# EAGLE schematic electric_xmas (EAGLE 6.3)

## Sheet 1 of 2
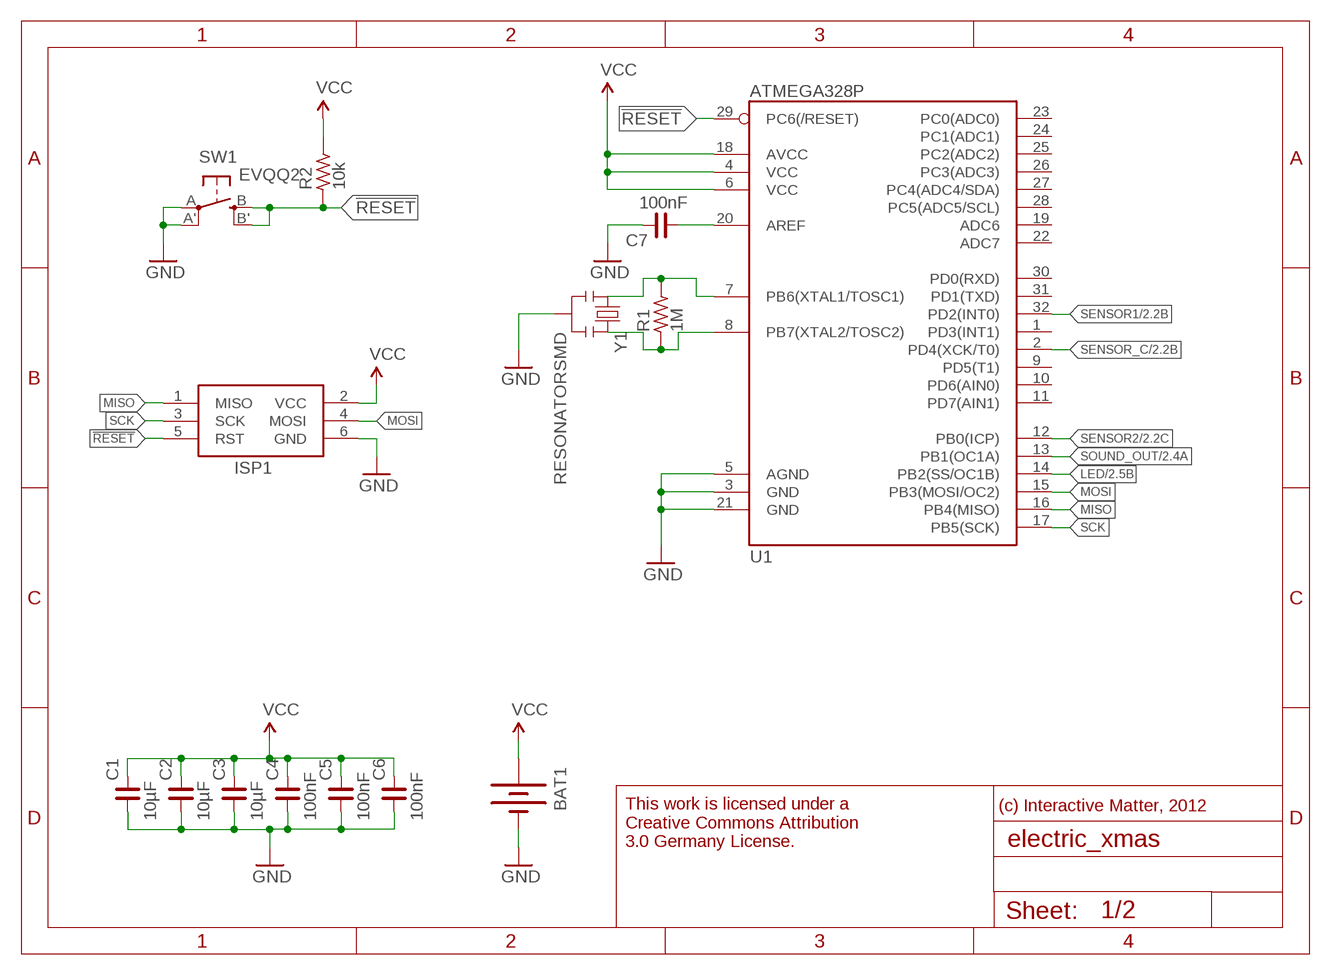
[diagram p0: schematic, sheet 1]

### Parts
BAT1  BATTERY20SMD  [BATTCON_20MM]
C1  10µF  C_0805  [C0805]
C2  10µF  C_0805  [C0805]
C3  10µF  C_0805  [C0805]
C4  100nF  C_0805  [C0805]
C5  100nF  C_0805  [C0805]
C6  100nF  C_0805  [C0805]
C7  100nF  C_0805  [C0805]
ISP1  AVRISP-6  [AVRISP]
R1  1M  R_0805  [R0805]
R2  10k  R_0805  [R0805]
SW1  EVQQ2  [EVQ-Q2]
U1  ATMEGA328P  ATMEGA168  [TQFP32-08]
Y1  RESONATORSMD  [RESONATOR-SMD]

### Nets
!RESET: ISP1.5(RST) R2.1 SW1.B'(S1) SW1.B(S) U1.29(PC6(/RESET))
GND: BAT1.2(-) C1.1 C2.1 C3.1 C4.1 C5.1 C6.1 C7.2 ISP1.6(GND) SW1.A'(P1) SW1.A(P) U1.3(GND) U1.5(AGND) U1.21(GND) Y1.2 ; also sheet 2
LED: U1.14(PB2(SS/OC1B)) ; also sheet 2
MISO: ISP1.1(MISO) U1.16(PB4(MISO))
MOSI: ISP1.4(MOSI) U1.15(PB3(MOSI/OC2))
N$1: R1.2 U1.7(PB6(XTAL1/TOSC1)) Y1.1
N$2: R1.1 U1.8(PB7(XTAL2/TOSC2)) Y1.3
N$5: C7.1 U1.20(AREF)
SCK: ISP1.3(SCK) U1.17(PB5(SCK))
SENSOR1: U1.32(PD2(INT0)) ; also sheet 2
SENSOR2: U1.12(PB0(ICP)) ; also sheet 2
SENSOR_C: U1.2(PD4(XCK/T0)) ; also sheet 2
SOUND_OUT: U1.13(PB1(OC1A)) ; also sheet 2
VCC: BAT1.1(+) C1.2 C2.2 C3.2 C4.2 C5.2 C6.2 ISP1.2(VCC) R2.2 U1.4(VCC) U1.6(VCC) U1.18(AVCC)
Unconnected: U1.1(PD3(INT1)) U1.9(PD5(T1)) U1.10(PD6(AIN0)) U1.11(PD7(AIN1)) U1.19(ADC6) U1.22(ADC7) U1.23(PC0(ADC0)) U1.24(PC1(ADC1)) U1.25(PC2(ADC2)) U1.26(PC3(ADC3)) U1.27(PC4(ADC4/SDA)) U1.28(PC5(ADC5/SCL)) U1.30(PD0(RXD)) U1.31(PD1(TXD))

### Notes on the sheet
- (c) Interactive Matter, 2012
- This work is licensed under a
  Creative Commons Attribution
  3.0 Germany License.

## Sheet 2 of 2
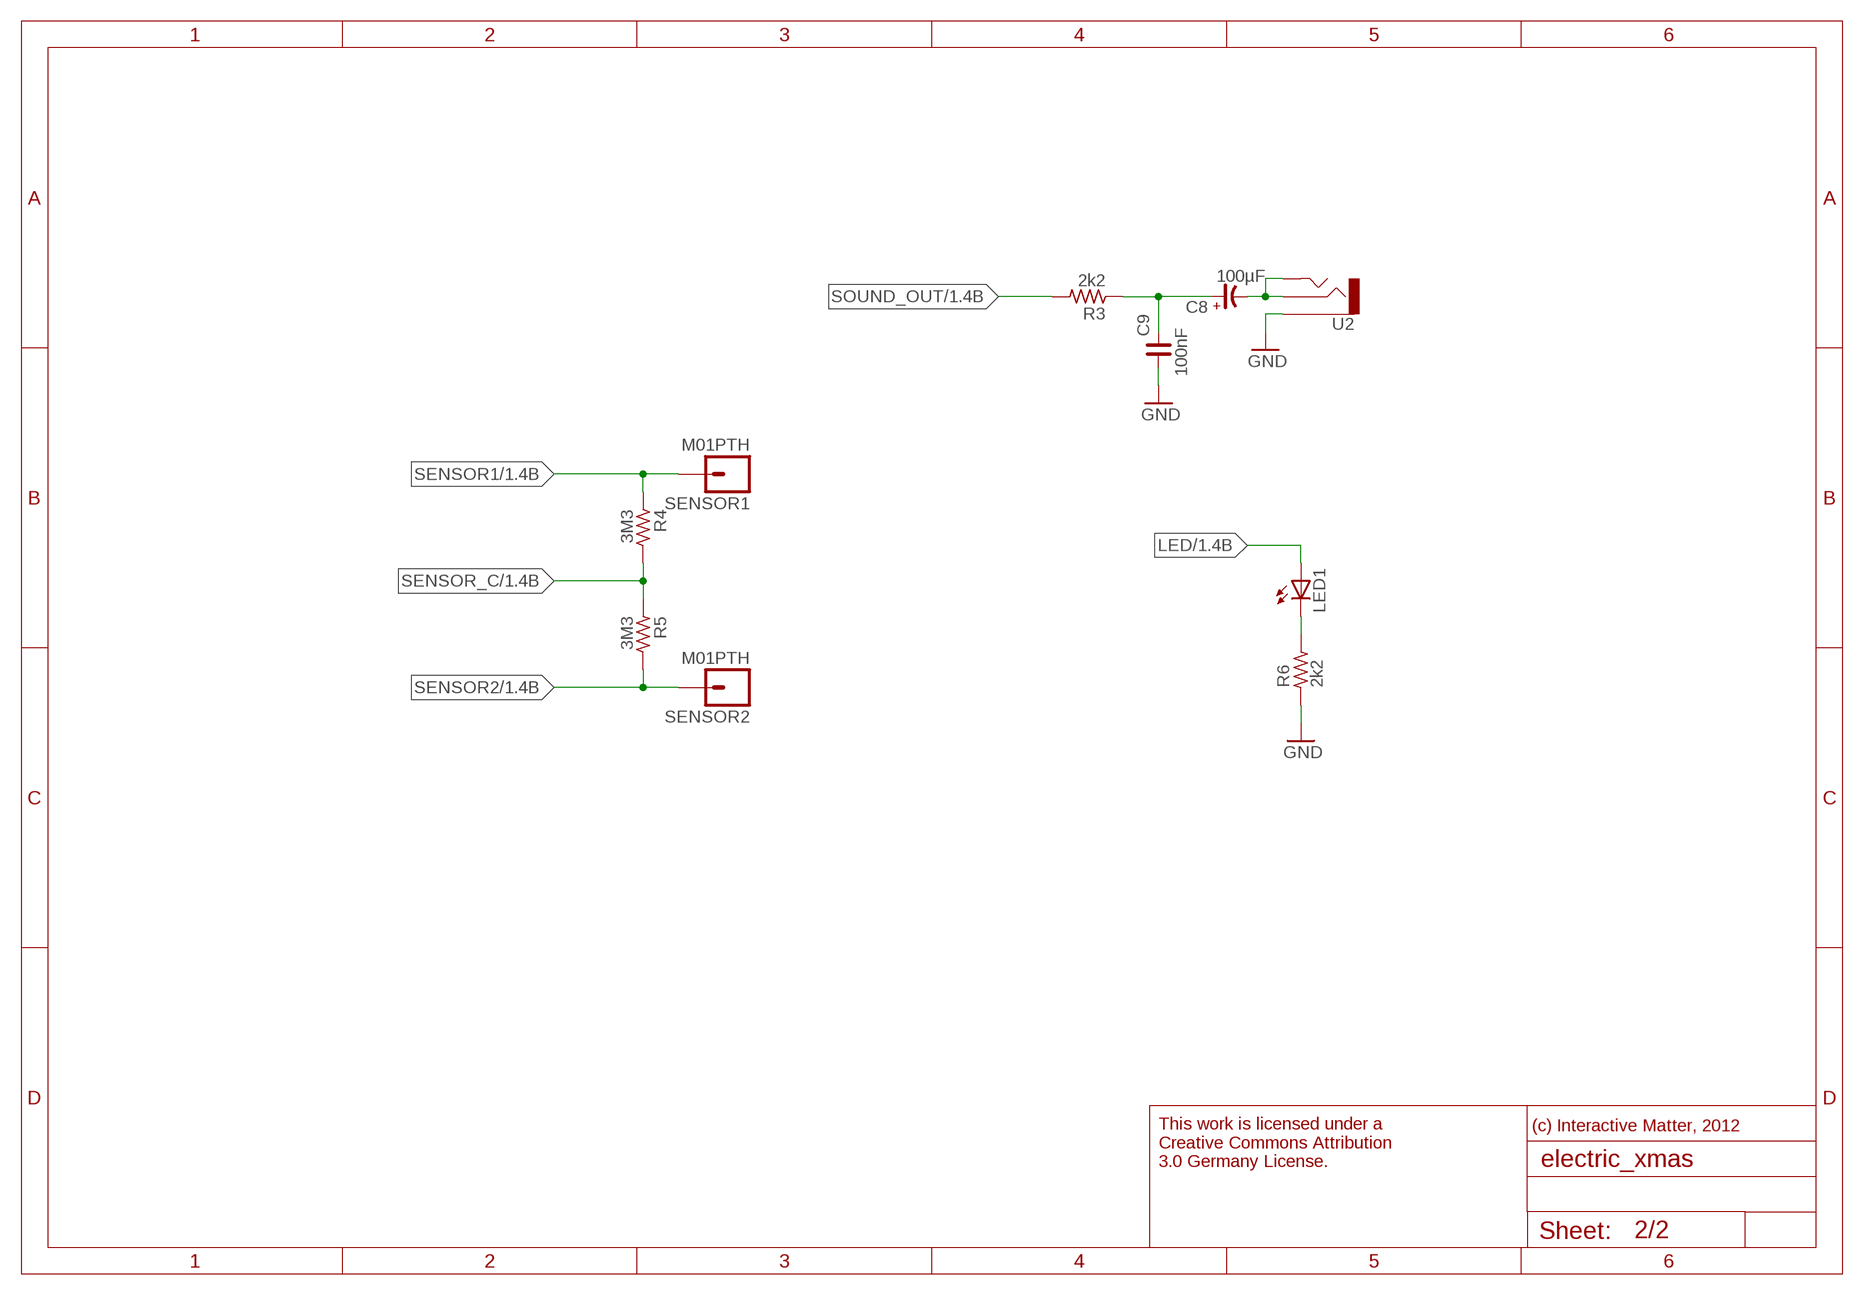
[diagram p1: schematic, sheet 2]

### Parts
C8  100µF  CP_SV-D  [CSV-D]
C9  100nF  C_0805  [C0805]
LED1  LEDLUMEXGW  [LUMEX_GW_BOTTOM]
R3  2k2  R_0805  [R0805]
R4  3M3  R_0805  [R0805]
R5  3M3  R_0805  [R0805]
R6  2k2  R_0805  [R0805]
SENSOR1  M01PTH  [1X01]
SENSOR2  M01PTH  [1X01]
U2  AUDIO-JACK  [LUMBERGRC-5325A]

### Nets
GND: C9.1 R6.1 U2.1 U2.2 ; also sheet 1
LED: LED1.A ; also sheet 1
N$3: LED1.C R6.2
N$4: C8.- U2.3 U2.4@1 U2.4@2
N$6: C8.+ C9.2 R3.1
SENSOR1: R4.1 SENSOR1.1 ; also sheet 1
SENSOR2: R5.2 SENSOR2.1 ; also sheet 1
SENSOR_C: R4.2 R5.1 ; also sheet 1
SOUND_OUT: R3.2 ; also sheet 1

### Notes on the sheet
- (c) Interactive Matter, 2012
- This work is licensed under a
  Creative Commons Attribution
  3.0 Germany License.

## Library data of the parts
BAT1 = SparkFun:BATTERY: Battery Holders Various common sizes : AA, AAA, 20mm coin cell and 12mm coin cell.
C1-C7 C9 = rc-master-smd:C_: NON-POLARIZED CAP
C8 = rc-master-smd:CP_: POLARIZED CAP
ISP1 = adafruit:AVRISP: AVR ISP HEADER Standard 6 pin header for AVR programming
LED1 = ElectricChristmas:LED: LEDs Standard schematic elements and footprints for 5mm, 3mm, 1206, and 0603 sized LEDs. 5mm - Spark Fun Electronics SKU : COM-00529 (and others)
R1-R6 = rc-master-smd:R_: RESISTOR
SENSOR1 SENSOR2 = SparkFun:M01: Header 1 Standard 1-pin 0.1" header. Use with straight break away headers (SKU : PRT-00116), right angle break away headers (PRT-00553), swiss pins (PRT-00743), machine pins (PRT-00117), and female headers (PRT-00115).
SW1 = adafruit:EVQQ2: SMT 6mm switch, EVQQ2 series http://www.ladyada.net/library/eagle
U1 = SparkFun:ATMEGA168
U2 = ElectricChristmas:AUDIO-JACK: 3.5mm Audio Jack Simple 3.5mm common PCB mount audio jack. SKU: PRT-08032
Y1 = ElectricChristmas:RESONATOR: Resonator Small SMD resonator. This is the itty bitty 10/20MHz resonators with built in caps. CSTCE10M0G55 and CSTCE20M0V53. Footprint has been reviewed closely but hasn't been tested yet.